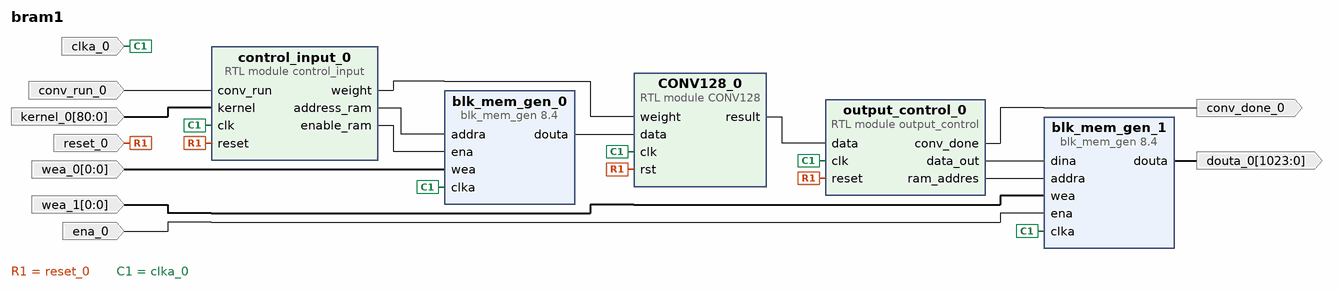
[diagram p0: block diagram of the top level]
# Vivado block design bram1, xc7a100tcsg324-1, Vivado 2020.1
create_bd_design bram1

create_bd_port -dir I -type clk clka_0
create_bd_port -dir I -type rst reset_0
create_bd_port -dir I conv_run_0
create_bd_port -dir O -from 1023 -to 0 douta_0
create_bd_port -dir I -from 0 -to 0 wea_0
create_bd_port -dir O conv_done_0
create_bd_port -dir I -from 0 -to 0 wea_1
create_bd_port -dir I ena_0
create_bd_port -dir I -from 80 -to 0 kernel_0

create_bd_cell -type ip -vlnv xilinx.com:ip:blk_mem_gen:8.4 blk_mem_gen_0
set_property -dict [list \
  CONFIG.Coe_File ../../../../../../../../elo/project_1/image.coe \
  CONFIG.Enable_32bit_Address false \
  CONFIG.Load_Init_File true \
  CONFIG.Read_Width_A 1040 \
  CONFIG.Register_PortA_Output_of_Memory_Primitives false \
  CONFIG.Use_Byte_Write_Enable false \
  CONFIG.Use_RSTA_Pin false \
  CONFIG.Write_Depth_A 130 \
  CONFIG.Write_Width_A 1040 \
  CONFIG.use_bram_block Stand_Alone \
] [get_bd_cells blk_mem_gen_0]
create_bd_cell -type ip -vlnv xilinx.com:ip:blk_mem_gen:8.4 blk_mem_gen_1
set_property -dict [list \
  CONFIG.Enable_32bit_Address false \
  CONFIG.Read_Width_A 1024 \
  CONFIG.Register_PortA_Output_of_Memory_Primitives false \
  CONFIG.Use_Byte_Write_Enable false \
  CONFIG.Use_RSTA_Pin false \
  CONFIG.Write_Depth_A 128 \
  CONFIG.Write_Width_A 1024 \
  CONFIG.use_bram_block Stand_Alone \
] [get_bd_cells blk_mem_gen_1]
create_bd_cell -type module -reference CONV128 CONV128_0
create_bd_cell -type module -reference control_input control_input_0
create_bd_cell -type module -reference output_control output_control_0

# ---- connections ----

connect_bd_net [get_bd_pins control_input_0/address_ram] [get_bd_pins blk_mem_gen_0/addra]
connect_bd_net [get_bd_pins control_input_0/weight] [get_bd_pins CONV128_0/weight]
connect_bd_net [get_bd_pins blk_mem_gen_0/douta] [get_bd_pins CONV128_0/data]
connect_bd_net [get_bd_pins CONV128_0/result] [get_bd_pins output_control_0/data]
connect_bd_net [get_bd_pins control_input_0/enable_ram] [get_bd_pins blk_mem_gen_0/ena]
connect_bd_net -net reset_0_1 [get_bd_ports reset_0] \
  [get_bd_pins CONV128_0/rst] [get_bd_pins control_input_0/reset] [get_bd_pins output_control_0/reset]
connect_bd_net -net conv_run_0_1 [get_bd_ports conv_run_0] [get_bd_pins control_input_0/conv_run]
connect_bd_net [get_bd_pins output_control_0/data_out] [get_bd_pins blk_mem_gen_1/dina]
connect_bd_net [get_bd_pins blk_mem_gen_1/douta] [get_bd_ports douta_0]
connect_bd_net -net wea_0_1 [get_bd_ports wea_0] [get_bd_pins blk_mem_gen_0/wea]
connect_bd_net [get_bd_pins output_control_0/conv_done] [get_bd_ports conv_done_0]
connect_bd_net -net wea_1_1 [get_bd_ports wea_1] [get_bd_pins blk_mem_gen_1/wea]
connect_bd_net -net ena_0_1 [get_bd_ports ena_0] [get_bd_pins blk_mem_gen_1/ena]
connect_bd_net -net clka_0_1 [get_bd_ports clka_0] \
  [get_bd_pins blk_mem_gen_1/clka] [get_bd_pins blk_mem_gen_0/clka] [get_bd_pins CONV128_0/clk] \
  [get_bd_pins control_input_0/clk] [get_bd_pins output_control_0/clk]
connect_bd_net [get_bd_pins output_control_0/ram_addres] [get_bd_pins blk_mem_gen_1/addra]
connect_bd_net -net kernel_0_1 [get_bd_ports kernel_0] [get_bd_pins control_input_0/kernel]

validate_bd_design
save_bd_design
